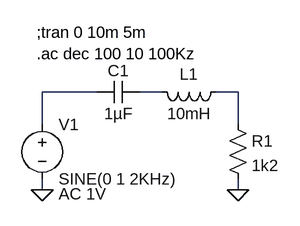
[diagram p0: schematic Exp2_P3.asc]
Exp2_P3.asc, the LTspice schematic file:
Version 4
SHEET 1 880 680
WIRE 192 240 112 240
WIRE 288 240 256 240
WIRE 400 240 368 240
WIRE 112 288 112 240
WIRE 400 288 400 240
WIRE 112 384 112 368
WIRE 400 384 400 368
FLAG 400 384 0
FLAG 112 384 0
SYMBOL voltage 112 272 R0
WINDOW 123 24 118 Left 2
SYMATTR Value2 AC 1V
SYMATTR InstName V1
SYMATTR Value SINE(0 1 2KHz)
SYMBOL cap 192 256 R270
WINDOW 0 32 32 VTop 2
WINDOW 3 0 32 VBottom 2
SYMATTR InstName C1
SYMATTR Value 1µF
SYMBOL ind 384 224 R90
WINDOW 0 5 56 VBottom 2
WINDOW 3 32 56 VTop 2
SYMATTR InstName L1
SYMATTR Value 10mH
SYMBOL res 384 272 R0
SYMATTR InstName R1
SYMATTR Value 1k2
TEXT 104 152 Left 2 !;tran 0 10m 5m\n.ac dec 100 10 100Kz

The netlist it stands for:
* Exp2_P3.asc
V1 N001 0 SINE(0 1 2KHz) AC 1V
C1 N001 N002 1µF
L1 N003 N002 10mH
R1 N003 0 1k2
;tran 0 10m 5m
.ac dec 100 10 100Kz
.backanno
.end